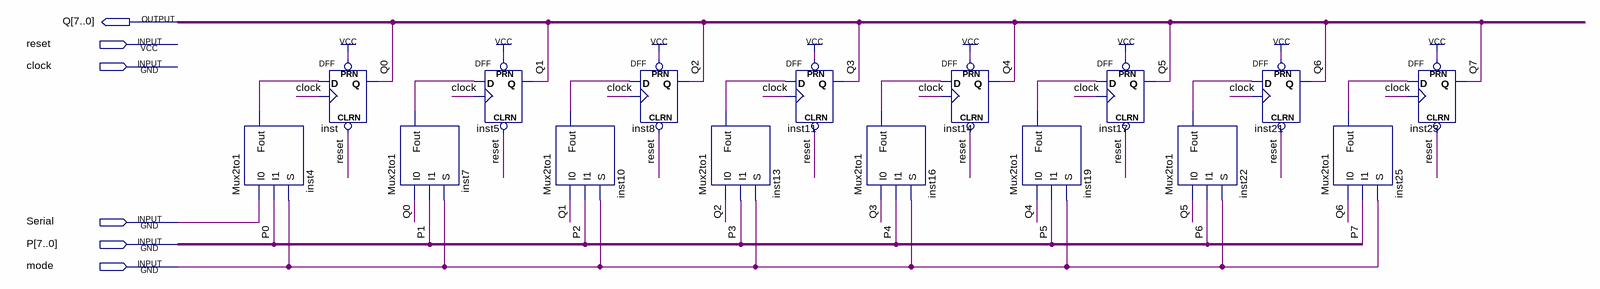
[diagram p0: schematic sheet]
// Quartus schematic 8bitShReg.bdf as structural Verilog: 16 symbols, 6 pins
module \8bitShReg  (
  input  reset,
  input  clock,
  input  Serial,
  input  [7:0] P,
  input  mode,
  output [7:0] Q
);

  wire inst4_fout, inst7_fout, inst10_fout, inst13_fout, inst16_fout, inst19_fout, inst22_fout, inst25_fout;

  Mux2to1 inst4 (.I0(Serial), .I1(P[0]), .S(mode), .Fout(inst4_fout));
  DFF inst (.CLRN(reset), .CLK(clock), .D(inst4_fout), .PRN(1'b1), .Q(Q[0]));
  Mux2to1 inst7 (.I0(Q[0]), .I1(P[1]), .S(mode), .Fout(inst7_fout));
  DFF inst5 (.CLRN(reset), .CLK(clock), .D(inst7_fout), .PRN(1'b1), .Q(Q[1]));
  Mux2to1 inst10 (.I0(Q[1]), .I1(P[2]), .S(mode), .Fout(inst10_fout));
  DFF inst8 (.CLRN(reset), .CLK(clock), .D(inst10_fout), .PRN(1'b1), .Q(Q[2]));
  Mux2to1 inst13 (.I0(Q[2]), .I1(P[3]), .S(mode), .Fout(inst13_fout));
  DFF inst11 (.CLRN(reset), .CLK(clock), .D(inst13_fout), .PRN(1'b1), .Q(Q[3]));
  Mux2to1 inst16 (.I0(Q[3]), .I1(P[4]), .S(mode), .Fout(inst16_fout));
  DFF inst14 (.CLRN(reset), .CLK(clock), .D(inst16_fout), .PRN(1'b1), .Q(Q[4]));
  Mux2to1 inst19 (.I0(Q[4]), .I1(P[5]), .S(mode), .Fout(inst19_fout));
  DFF inst17 (.CLRN(reset), .CLK(clock), .D(inst19_fout), .PRN(1'b1), .Q(Q[5]));
  Mux2to1 inst22 (.I0(Q[5]), .I1(P[6]), .S(mode), .Fout(inst22_fout));
  DFF inst21 (.CLRN(reset), .CLK(clock), .D(inst22_fout), .PRN(1'b1), .Q(Q[6]));
  Mux2to1 inst25 (.I0(Q[6]), .I1(P[7]), .S(mode), .Fout(inst25_fout));
  DFF inst23 (.CLRN(reset), .CLK(clock), .D(inst25_fout), .PRN(1'b1), .Q(Q[7]));
endmodule
